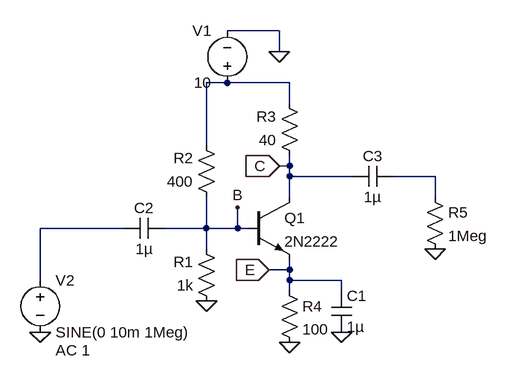
[diagram p0: schematic Draft15.asc]
Draft15.asc, the LTspice schematic file:
Version 4
SHEET 1 880 680
WIRE 224 -96 144 -96
WIRE 224 -64 224 -96
WIRE 144 -16 112 -16
WIRE 240 -16 144 -16
WIRE 240 16 240 -16
WIRE 112 80 112 -16
WIRE 240 112 240 96
WIRE 240 112 224 112
WIRE 240 128 240 112
WIRE 336 128 240 128
WIRE 464 128 400 128
WIRE 240 160 240 128
WIRE 464 160 464 128
WIRE -16 208 -144 208
WIRE 112 208 112 160
WIRE 112 208 48 208
WIRE 160 208 160 176
WIRE 160 208 112 208
WIRE 176 208 160 208
WIRE 112 240 112 208
WIRE 240 272 240 256
WIRE 240 272 208 272
WIRE -144 288 -144 208
WIRE 240 288 240 272
WIRE 320 288 240 288
WIRE 240 304 240 288
WIRE 320 304 320 288
FLAG 240 384 0
FLAG 320 368 0
FLAG 464 240 0
FLAG -144 368 0
FLAG 224 -64 0
FLAG 112 320 0
FLAG 224 112 C
IOPIN 224 112 In
FLAG 160 176 B
FLAG 208 272 E
IOPIN 208 272 In
SYMBOL npn 176 160 R0
SYMATTR InstName Q1
SYMATTR Value 2N2222
SYMBOL res 128 336 R180
WINDOW 0 36 76 Left 2
WINDOW 3 36 40 Left 2
SYMATTR InstName R1
SYMATTR Value 1k
SYMBOL res 128 176 R180
WINDOW 0 36 76 Left 2
WINDOW 3 36 40 Left 2
SYMATTR InstName R2
SYMATTR Value 400
SYMBOL res 256 112 R180
WINDOW 0 36 76 Left 2
WINDOW 3 36 40 Left 2
SYMATTR InstName R3
SYMATTR Value 40
SYMBOL res 224 288 R0
SYMATTR InstName R4
SYMATTR Value 100
SYMBOL cap 304 304 R0
SYMATTR InstName C1
SYMATTR Value 1µ
SYMBOL cap 48 192 R90
WINDOW 0 0 32 VBottom 2
WINDOW 3 32 32 VTop 2
SYMATTR InstName C2
SYMATTR Value 1µ
SYMBOL cap 400 112 R90
WINDOW 0 0 32 VBottom 2
WINDOW 3 32 32 VTop 2
SYMATTR InstName C3
SYMATTR Value 1µ
SYMBOL voltage 144 0 R180
WINDOW 0 24 96 Left 2
WINDOW 3 24 16 Left 2
WINDOW 123 0 0 Left 0
WINDOW 39 0 0 Left 0
SYMATTR InstName V1
SYMATTR Value 10
SYMBOL voltage -144 272 R0
WINDOW 123 24 124 Left 2
WINDOW 39 0 0 Left 0
SYMATTR InstName V2
SYMATTR Value SINE(0 10m 1Meg)
SYMATTR Value2 AC 1
SYMBOL res 448 144 R0
SYMATTR InstName R5
SYMATTR Value 1Meg

The netlist it stands for:
* Draft15.asc
Q1 C B E 0 2N2222
R1 0 B 1k
R2 B N001 400
R3 C N001 40
R4 E 0 100
C1 E 0 1µ
C2 B N003 1µ
C3 N002 C 1µ
V1 N001 0 10
V2 N003 0 SINE(0 10m 1Meg) AC 1
R5 N002 0 1Meg
.model NPN NPN
.model PNP PNP
.lib standard.bjt
.backanno
.end